# Altium schematic sheet GSM.SchDoc: GSM
size A4; SheetNumber: 5
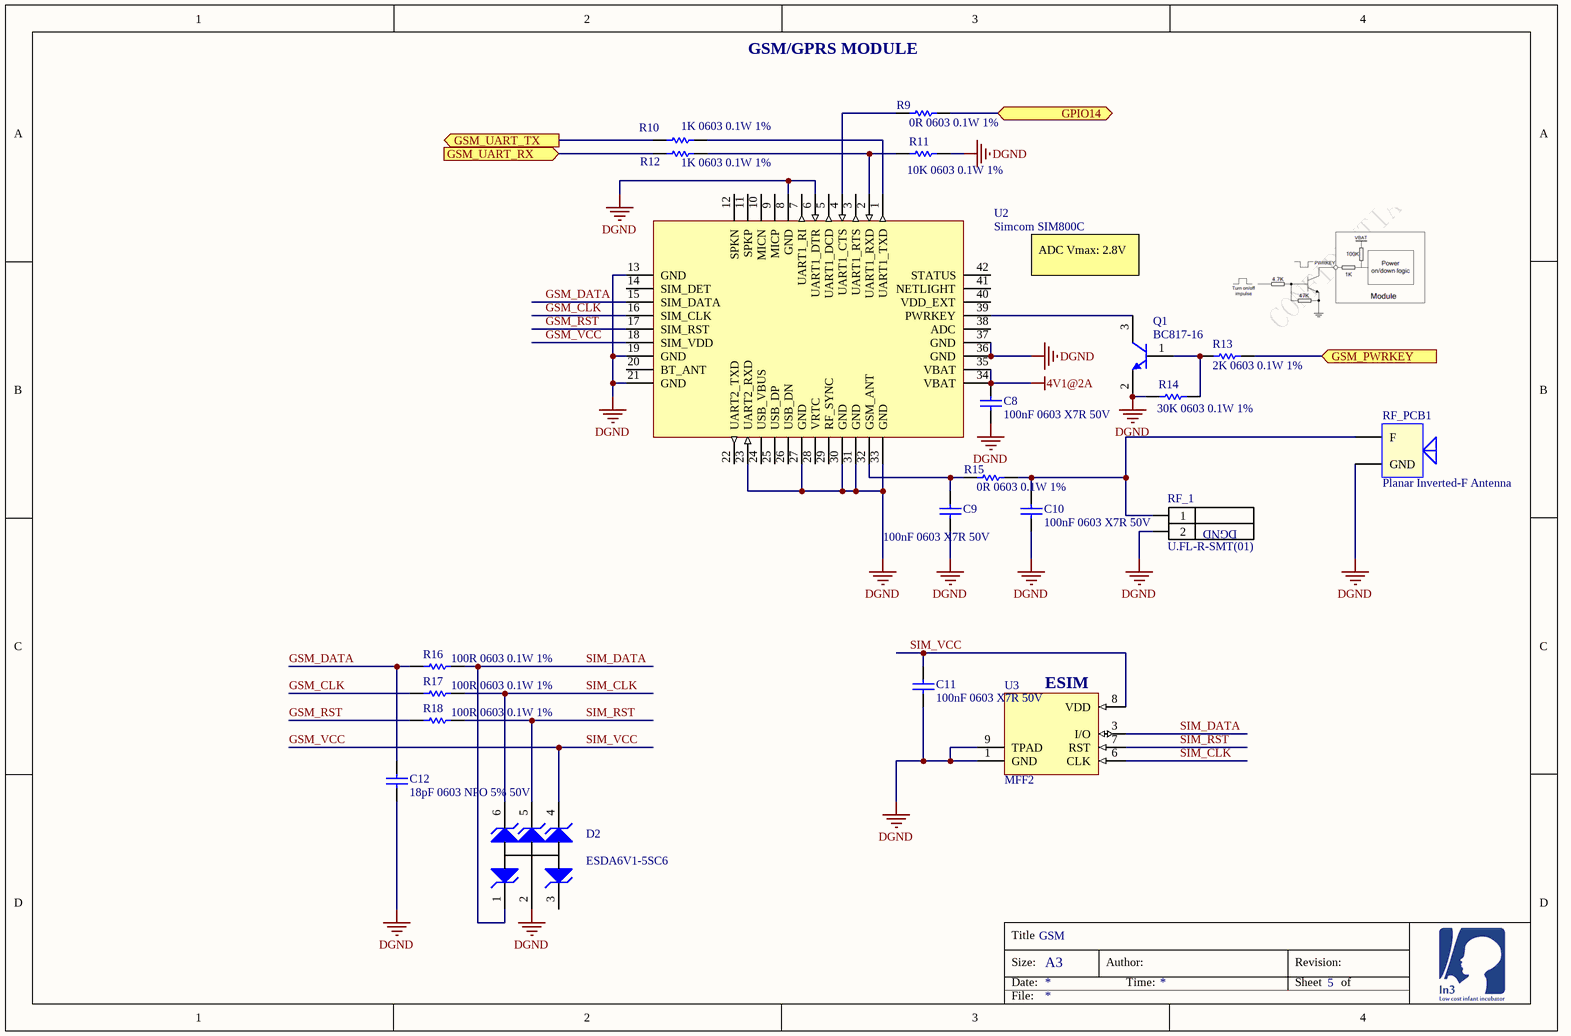
[diagram p0: GSM.SchDoc]

## Parts
C8  100nF 0603 X7R 50V  [CAPC1608X60X35NL10T15]
C9  100nF 0603 X7R 50V  [CAPC1608X60X35NL10T15]
C10  100nF 0603 X7R 50V  [CAPC1608X60X35NL10T15]
C11  100nF 0603 X7R 50V  [CAPC1608X60X35NL10T15]
C12  18pF 0603 NPO 5% 50V  [CAPC1608X60X35NL10T15]
D2  ESDA6V1-5SC6  [MF06A_N]
Q1  BC817-16  [PCB-856332-1]
R9  0R 0603 0.1W 1%  [RESC1609X55X30ML10T20]
R10  1K 0603 0.1W 1%  [RESC1609X55X30ML10T20]
R11  10K 0603 0.1W 1%  [RESC1609X55X30ML10T20]
R12  1K 0603 0.1W 1%  [RESC1609X55X30ML10T20]
R13  2K 0603 0.1W 1%  [RESC1609X55X30ML10T20]
R14  30K 0603 0.1W 1%  [RESC1609X55X30ML10T20]
R15  0R 0603 0.1W 1%  [RESC1609X55X30ML10T20]
R16  100R 0603 0.1W 1%  [RESC1609X55X30ML10T20]
R17  100R 0603 0.1W 1%  [RESC1609X55X30ML10T20]
R18  100R 0603 0.1W 1%  [RESC1609X55X30ML10T20]
RF_1  U.FL-R-SMT(01)  [PCB-ci0d6ius1xp1vci7q9ug-1]
RF_PCB1  Planar Inverted-F Antenna  [PCB-exfs4yavada8317p37z6-1]  (no BOM)
U2  Simcom SIM800C  [SIM800C]
U3  MFF2  [SON127P600X95_HS-9N]

## Ports
GPIO14, GSM_PWRKEY (in), GSM_UART_RX (in), GSM_UART_TX (out)

## Nets
4V1@2A: C8.2 U2.34(VBAT) U2.35(VBAT)
DGND: C8.1 C9.1 C10.1 C11.1 C12.1 D2.2(K) Q1.2(E) R11.2 R14.2 RF_1.2 RF_PCB1.2(GND) U2.6(UART1_DTR) U2.8(GND) U2.13(GND) U2.19(GND) U2.21(GND) U2.23(UART2_RXD) U2.27(GND) U2.30(GND) U2.31(GND) U2.33(GND) U2.36(GND) U2.37(GND) U3.1(GND) U3.9(TPAD)
GPIO14: R9.2 ; port GPIO14
GSM_CLK: R17.2 U2.16(SIM_CLK)
GSM_DATA: C12.2 R16.2 U2.15(SIM_DATA)
GSM_PWRKEY: R13.1 ; port GSM_PWRKEY
GSM_RST: R18.2 U2.17(SIM_RST)
GSM_UART_RX: R12.1 ; port GSM_UART_RX
GSM_UART_TX: R10.1 ; port GSM_UART_TX
GSM_VCC: C11.2 D2.4(A) U2.18(SIM_VDD) U3.8(VDD)  [also labelled SIM_VCC]
SIM_CLK: D2.6(A) R17.1 U3.6(CLK)
SIM_DATA: D2.1(K) R16.1 U3.3(I/O)
SIM_RST: D2.5(A) R18.1 U3.7(RST)
NetC9_2: C9.2 R15.1 U2.32(GSM_ANT)
NetC10_2: C10.2 R15.2 RF_1.1 RF_PCB1.1(F)
NetQ1_1: Q1.1(B) R13.2 R14.1
NetQ1_3: Q1.3(C) U2.39(PWRKEY)
NetR9_1: R9.1 U2.4(UART1_CTS)
NetR10_2: R10.2 U2.1(UART1_TXD)
NetR11_1: R11.1 R12.2 U2.2(UART1_RXD)

Not connected (* = marked no-connect by the designer): D2 3(K); U2 3(UART1_RTS) 5(UART1_DCD) 7(UART1_RI) 9(MICP) 10(MICN) 11(SPKP) 12(SPKN) 14(SIM_DET) 20(BT_ANT) 22(UART2_TXD) 24(USB_VBUS) 25(USB_DP) 26(USB_DN) 28(VRTC) 29(RF_SYNC) 38(ADC) 40(VDD_EXT) 41(NETLIGHT) 42(STATUS)

## Notes on the sheet
- GSM/GPRS MODULE
- ADC Vmax: 2.8V
- (near U3) ESIM
- Title
- Size:
- Date:
- A3
- Author:
- Time:
- Revision:
- Sheet
- of
- File:
- (in symbol CMP-b06f7b3edcee6fa8-4) DGND

## Library data of the parts
C8-C11 = CMP-c41a0d2b65641bdd-3: 100nF 0603 X7R 25V; package: 0603; capacitance: 100 nF; Dielectric Characteristic: X7R; Rated voltage: 25V
C12 = CMP-35cbf9f8b0acea0c-1: Manufacturer Part Number: C0603C180K5RACTU; Capacitance: 18.0 pF; Capacitance Tolerance: ±10%; Dielectric Characteristic: X7R; Dielectric Material: Ceramic; Lead-Free Status: R; Voltage Rating (DC): 50.0 V; Octopart URL: https://octopart.com/c0603c180k5racauto-kemet-87662593; Case/Package: 0603; Mounting Style: Surface Mount; Operating Temperature: -55.0 °C (min); RoHS: Compliant; OctopartID: 35cbf9f8b0acea0c
D2 = CMP-924f5b40f9684d88-1: ESDA Series 5 Channel 6.1 V 50 pF SMT Uni Directional Transil Array - SOT-23-6L; Operating Voltage: 6.10 V; Power Rating: 100 W; Breakdown Voltage: 7.20 V; Lead-Free Status: Lead Free; REACH SVHC Compliance: No SVHC; Number of Pins: 6; Case/Package: SOT-23; Size-Width: 1.75 mm; Mounting Style: Surface Mount; Manufacturer Part Number: ESDA6V1-5SC6; Size-Height: 1.45 mm; OctopartID: 924f5b40f9684d88; Size-Length: 3.05 mm; Packaging: Tape & Reel (TR), Cut Tape (CT); Octopart URL: http://octopart.com/esda6v1-5sc6-stmicroelectronics-347713; RoHS: Compliant; Voltage Rating (DC): 6.10 V; Lifecycle Status: Active; TME: ESDA6V1-5SC6
Q1 = CMP-856332-3: TRANS NPN 45V 500mA SMD SOT23-3; Current Rating: 0.6 A; Lead-Free Status: Lead Free; Power Dissipation: 0.3 W; Voltage Rating (DC): 40.0 V; Case/Package: SOT-23; Lifecycle Status: Active; Mounting Style: Surface Mount; Number of Pins: 3; Octopart Url: https://octopart.com/mmbt2222a-7-f-diodes+inc.-357838; OctopartID: 53a79aa8030f8c60; Packaging: Cut Tape (CT); Polarity: NPN; REACH SVHC Compliance: No SVHC; RoHS: Compliant
R9 R15 = CMP-536b9a7387ce8cac-10: HelpURL: http://www.yageo.com/documents/recent/PYu-RC_Group_51_RoHS_L_9.pdf; Resistance: 0R; package: 0603
R10 R12 = CMP-a61f6f36030f79d8-4: Manufacturer Part Number: CR0603-FX-1001ELF; Power Rating: 100 mW; Case/Package (SI): 1608; Voltage Rating (DC): 50.0 V; Temperature Coefficient: -100 ppm/°C to 100 ppm/°C; REACH SVHC Compliance: No SVHC; Packaging: Tape & Reel (TR), Cut Tape (CT); Resistance Tolerance: ±1%; Resistance: 1k; RoHS: Compliant; Mounting Style: Surface Mount; Number of Pins: 2; Size-Length: 1.60 mm; Octopart URL: https://octopart.com/cr0603-fx-1001elf-bourns-2326646; Size-Thickness: 457 µm; OctopartID: a61f6f36030f79d8; Size-Width: 787 µm; Case/Package: 0603
R11 = CMP-4716590-9: Octopart Url: https://octopart.com/crcw060310k0fkeahp-vishay-42634028; package: 0603; Resistance: 10k; Tolerance: 1%
R13 R14 = CMP-3655986-6: Tolerance: 1%; package: 0603
  R13: Resistance: 2K
  R14: Resistance: 30k
R16-R18 = CMP-a61f6f36030f79d8-4: Manufacturer Part Number: CR0603-FX-1001ELF; Power Rating: 100 mW; Resistance: 1k; Case/Package (SI): 1608; Voltage Rating (DC): 50.0 V; Temperature Coefficient: -100 ppm/°C to 100 ppm/°C; REACH SVHC Compliance: No SVHC; Packaging: Tape & Reel (TR), Cut Tape (CT); Resistance Tolerance: ±1%; RoHS: Compliant; Mounting Style: Surface Mount; Number of Pins: 2; Size-Length: 1.60 mm; Octopart URL: https://octopart.com/cr0603-fx-1001elf-bourns-2326646; Size-Thickness: 457 µm; OctopartID: a61f6f36030f79d8; Size-Width: 787 µm; Case/Package: 0603
RF_1 = CMP-b06f7b3edcee6fa8-4: Connector RF Coaxial Data Midget Coaxial; DNP: DNP
RF_PCB1 = CMP-e704afk8c25r4a5ypw1c-3: GSM900 and GSM1800  Frequency Bands PCB antenna; CustomComponentID: e704afk8c25r4a5ypw1c
U2 = CMP-72dbb8ea0133ad1c-5: Module: GSM/Bluetooth; GPRS; 2G; 1800MHz, 900MHz; 85.6kbps; SMD; OctopartID: 72dbb8ea0133ad1c; Manufacturer Part Number: SIM800C; Mounting Style: Surface Mount; Octopart URL: http://octopart.com/sim800c-simcom-54220430
U3 = CMP-ce8f06c57f401148-2: Embedded SIM card in MFF2; DNP: DNP